# Altium schematic sheet 6_ECU.SchDoc
size A4; SheetNumber: 6; SheetTotal: 7
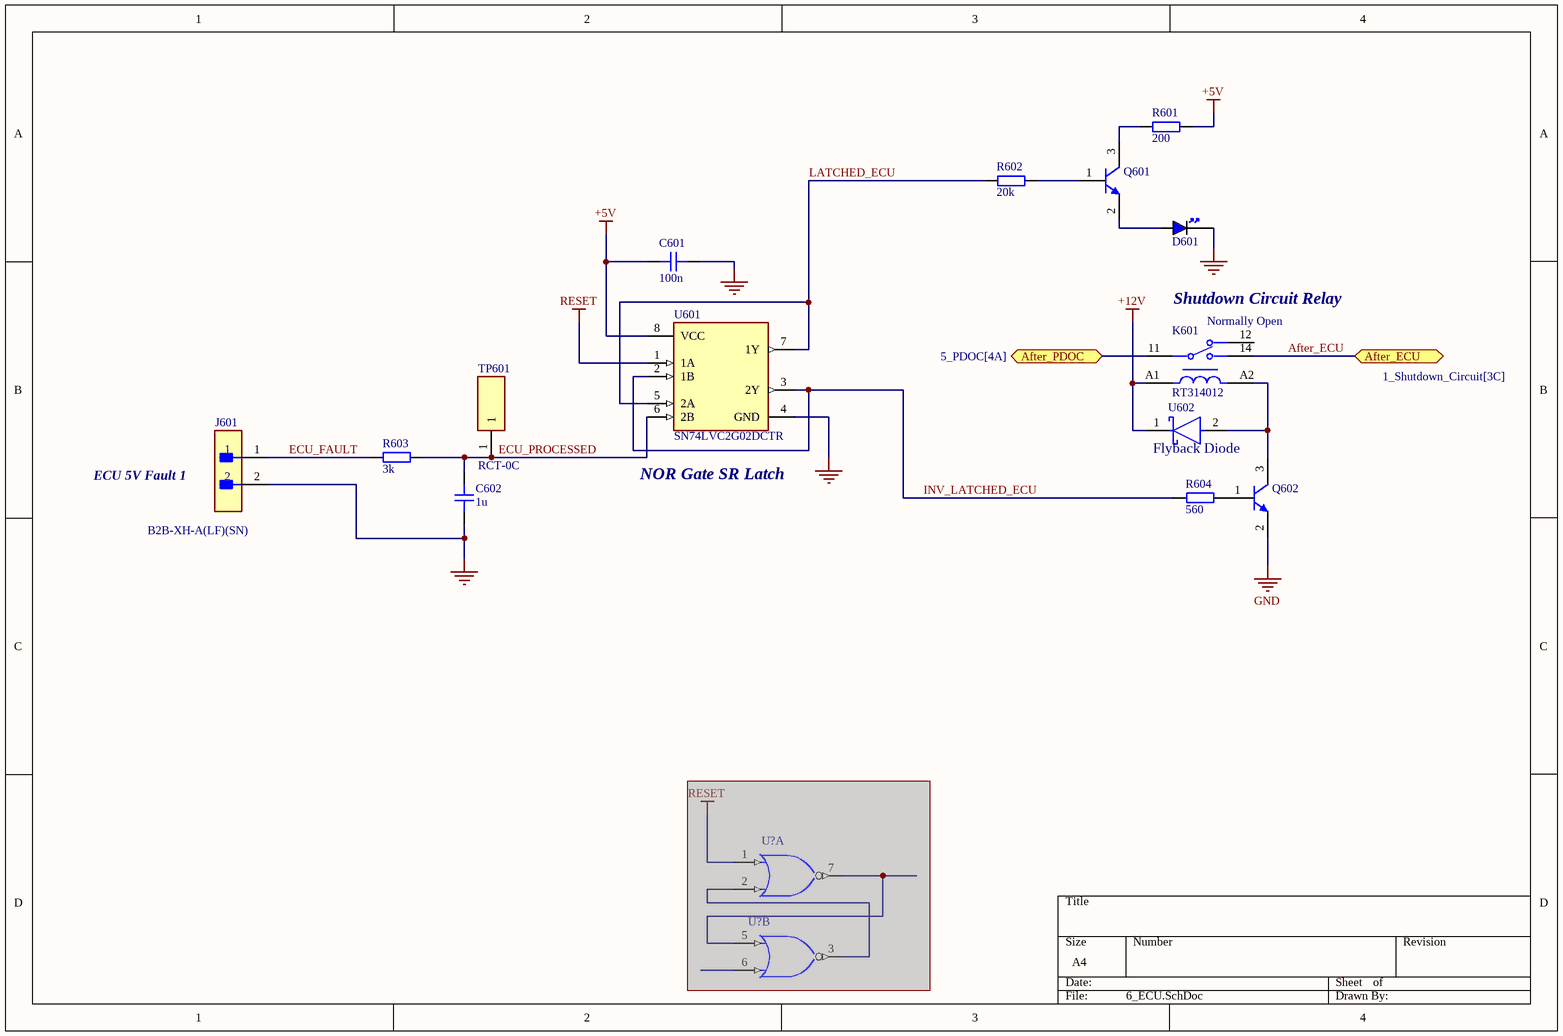
[diagram p0: 6_ECU.SchDoc]

## Parts
(Parts that share a designator on the sheet are numbered #1, #2 ... from top to bottom, then left to right.)
C601  100n  [CAP_0805]
C602  1u  [CAP_0805]
D601  BLUE  [LED_0805_BLUE]  (value not drawn)
J601  B2B-XH-A(LF)(SN)  [FP-B2B-XH-A_LF_SN-MFG]
K601  RT314012  [FP-RT314012-MFG]
Q601  MMBT5550LT1G  [ONSC-SOT-23-3-318-08_V]  (value not drawn)
Q602  MMBT5550LT1G  [ONSC-SOT-23-3-318-08_V]  (value not drawn)
R601  200  [RES_0805]
R602  20k  [RES_0805]
R603  3k  [RES_0805]
R604  560  [RES_0805]
TP601  RCT-0C  [RCT-0C]
U601  SN74LVC2G02DCTR  [FP-DCT0008A-IPC_A]
U602  BAT54JFILM  [FP-SOD323-MFG]  (value not drawn)
U?#1  SN74LVC2G02DCUT  [DCU0008A_N]  (value not drawn)  (part A of 3)  (masked out: inside a compile mask, not in the netlist)
U?#2  SN74LVC2G02DCUT  [DCU0008A_N]  (value not drawn)  (part B of 3)  (masked out: inside a compile mask, not in the netlist)

## Ports
After_ECU (bidir, see 1_Shutdown_Circuit[3C]), After_PDOC (bidir, see 5_PDOC[4A])

## Nets
+5V: C601.2 R601.2 U601.8(VCC)
+12V: K601.A1 U602.1(C)
GND: C601.1 C602.1 D601.K J601.2 Q602.2(E) U601.4(GND)
RESET: U601.1(1A)
After_ECU: K601.14 ; port After_ECU
After_PDOC: K601.11 ; port After_PDOC
ECU_FAULT: J601.1 R603.1
ECU_PROCESSED: C602.2 R603.2 TP601.1 U601.6(2B)
INV_LATCHED_ECU: R604.1 U601.2(1B) U601.3(2Y)
LATCHED_ECU: R602.2 U601.5(2A) U601.7(1Y)
NetD601_A: D601.A Q601.2(E)
NetK601_A2: K601.A2 Q602.3(C) U602.2(A)
NetQ601_1: Q601.1(B) R602.1
NetQ601_3: Q601.3(C) R601.1
NetQ602_1: Q602.1(B) R604.2

Not connected (* = marked no-connect by the designer): K601 12

## Notes on the sheet
- (near K601) Shutdown Circuit Relay
- (near K601) Normally Open
- ECU 5V Fault 1
- (near U601) NOR Gate SR Latch
- (near U602) Flyback Diode

## Library data of the parts
C601 C602 = CAP_0805: Capacitor SMD 0805; Manufacturer: *; Manufacturer Part Number: *; Distributor Link: *; LCSC: *; Rating: *; Dielectric: *
D601 = LED_0805_BLUE: LED 0805 BLUE SMD; Manufacturer: *; Manufacturer Part Number: *; Distributor Link: *; LCSC: *
J601 = CMP-2000-05888-3: CONN HEADER VERT 2POS 2.5MM; Current Rating: 3A; Voltage Rating: 250V; Number of Contacts: 2; Contact Resistance: 20mR; Wire/Cable Gauge: 22AWG; Insulation Resistance: 1GR; Connector Type: Male Pin; Packaging: Bulk; Contact Material: Brass; Lead Free: Lead Free; Orientation: Straight; Contact Plating: Tin; Max Current Rating: 3A; Termination: Solder; Fastening Type: Detent; Depth: 5.75mm; Housing Material: Polyamide; REACH SVHC: No SVHC; Series: XH; Voltage Rating (AC): 250V; Number of Positions: 2; Color: Natural; Contact Type: Male Pin; Max Voltage Rating (DC): 250V; Pitch: 2.5mm; Lead Pitch: 2.5mm; Mount: Through Hole; Max Operating Temperature: 85°C; Length: 7.4mm; Max Voltage Rating (AC): 250V; Min Operating Temperature: -25°C; Number of Rows: 1; Housing Color: White
K601 = CMP-03395-000105-1: RELAY GEN PURPOSE SPDT 16A 12V; Manufacturer: TE Connectivity; Coil Type: Non-Latching; Number Of Contacts: 1; Coil Power: 400mW; Coil Resistance: 360Ω; Device Class L2: Relays; Digikey Description: RELAY GEN PURPOSE SPDT 16A 12V; Coil Voltage: 12V; RoHS: TRUE; Category: Relay; Lead Free: Yes; Manufacturer Part Number: RT314012; ComponentLink2Description: Datasheet; Throw Configuration: SPDT; Current Rating: 16A; Ambient Temperature Range Low: -40°C; ComponentLink2URL: https://www.te.com/commerce/DocumentDelivery/DDEController?Action=showdoc&DocId=Data+Sheet%7FRT1%7F0219%7Fpdf%7FEnglish%7FENG_DS_RT1_0219.pdf%7F9-1393239-5; Automotive: No; Device Class L1: Electromechanical; Octopart: https://octopart.com/9-1393239-5-te+connectivity-46509288; Ambient Temperature Range High: +85°C; Height: 15.7mm; Package: RT314012; Device Class L3: Power Relays
Q601 Q602 = CMP-1048-00659-1: High Voltage Transistor, NPN Silicon, 3-Pin SOT-23, Pb-Free, Tape and Reel; Manufacturer: On Semiconductor; IC Continuous (A): 0.6; PackageDescription: 3-Pin Small Outline Transistor, Body 2.92 x 1.3 mm, Pitch 0.95 mm; ComponentLink3URL: http://www.onsemi.cn/pub_link/Collateral/318-08.PDF; RoHS: TRUE; ComponentLink2URL: http://www.onsemi.cn/pub_link/Collateral/MMBT5550LT1-D.PDF; DatasheetVersion: Rev. 10; ComponentLink1URL: http://www.onsemi.com/; PackageReference: SOT-23-3-318-08; PackageVersion: Rev. AP, 11/2009; Mounting Technology: Surface Mount; ComponentLink2Description: Datasheet; PartNumber: MMBT5550LT1G; ComponentLink3Description: Package Specification; Packing: Tape and Reel; Polarity: NPN; ComponentLink1Description: Manufacturer URL
R601-R604 = RES_0805: Resistor SMD 0805; Manufacturer: *; Manufacturer Part Number: *; Distributor Link: *; LCSC: *
TP601 = RCT-0C: Test Point; Manufacturer_Name: TE Connectivity; Datasheet Link: https://www.te.com/commerce/DocumentDelivery/DDEController?Action=srchrtrv&DocNm=1773266&DocType=Data%20Sheet&DocLang=English&PartCntxt=1625854-2&DocFormat=pdf; Manufacturer_Part_Number: RCT-0C; Mouser Part Number: 279-RCT-0C; Mouser Price/Stock: https://www.mouser.co.uk/ProductDetail/TE-Connectivity-Holsworthy/RCT-0C?qs=ip69W3eHERWzZOsRKmFYAw%3D%3D; Arrow Part Number: RCT-0C; Arrow Price/Stock: https://www.arrow.com/en/products/rct-0c/te-connectivity?region=nac
U601 = CMP-0859-00563-4: IC GATE NOR 2CH 2-INP SM8; Number of Outputs: 1; High Level Output Current: -32mA; Number of Bits: 2; Max Supply Voltage: 5.5V; Turn-On Delay Time: 4.4ns; Min Supply Voltage: 1.65V; Low Level Output Current: 32mA; Operating Supply Voltage: 3.3V; Quiescent Current: 10uA; Logic Function: NOR GATE; Max Operating Temperature: 125°C; Radiation Hardening: No; Number of Pins: 8; Lead Free: Lead Free; Packaging: Tape and Reel; Number of Gates: 2; Package Quantity: 1; Number of Elements: 2; REACH SVHC: No SVHC; Max Output Current: 32mA; Propagation Delay: 4.4ns; Termination: SMD/SMT; Number of Inputs: 2; Mount: Surface Mount; Output Current: 32mA; Case/Package: SSOP; Min Operating Temperature: -40°C; Weight: 0.000825oz; Number of Circuits: 2; Number of Output Lines: 1; RoHS Compliant: Yes; Number of Input Lines: 2
U602 = CMP-2000-05927-2: DIODE SCHOTTKY 40V 300MA SOD323; Manufacturer: STMicroelectronics; Max Surge Forward Current: 1.25A; Value: 7pF; Max Junction Temp: +150°C; Peak Reverse Current: 1uA; Standoff Height: 0mm; ComponentLink2Description: Datasheet; Device Class L2: Diodes; Mouser Description: Schottky Diodes & Rectifiers 300mA 40 Volt; Forward Current: 300mA; Temperature Range Low: -40°C; Temperature Range High: +150°C; Digikey Description: DIODE SCHOTTKY 40V 300MA SOD323; Capacitance: 7pF; Ipc Land Pattern Name: SOD250128X117-2; Automotive: No; Manufacturer Part Number: BAT54JFILM; Device Class L1: Discrete Semiconductors; Lead Free: Yes; ComponentLink2URL: https://www.st.com/resource/en/datasheet/bat54.pdf; Package: SOD323; Temperature: -40°C to +150°C; Category: IC; Height: 1.17mm; Octopart: https://octopart.com/bat54jfilm-stmicroelectronics-326073; RoHS: TRUE; Device Class L3: Schottky Diodes; Max Repetitive Reverse Voltage: 40V
U?#1 U?#2 = CMP-0859-00698-3: Dual 2-Input Positive-NOR Gate, DCU0008A, SMALL T&R; Manufacturer: Texas Instruments; Output Type: CMOS; Rating: Catalog; Input Type: CMOS/TTL; Schmitt Trigger: No; Logic: True; ICC @ Nom Voltage(Max)(mA): 0.01; Output Drive (IOL/IOH)(Max)(mA): 32/-32; Voltage(Nom)(V): 1.8,2.5,3.3,5; tpd @ Nom Voltage(Max)(ns): 10.9,6.4,5.9,5.4; Gate Type: NOR; VCC(Min)(V): 1.65; VCC(Max)(V): 5.5; F @ Nom Voltage(Max)(Mhz): 150; Bits(#): 2; Technology Family: LVC; Operating Temperature Range(C): -40 to 125; DatasheetVersion: SCES194M; Generic Part Number: SN74LVC2G02; PackageReference: DCU0008A; 3-State Output: No; Sub-Family: NOR Gate